# Altium schematic sheet Microphone.SchDoc
size A4; DocumentNumber: 8; SheetNumber: 8; SheetTotal: 8
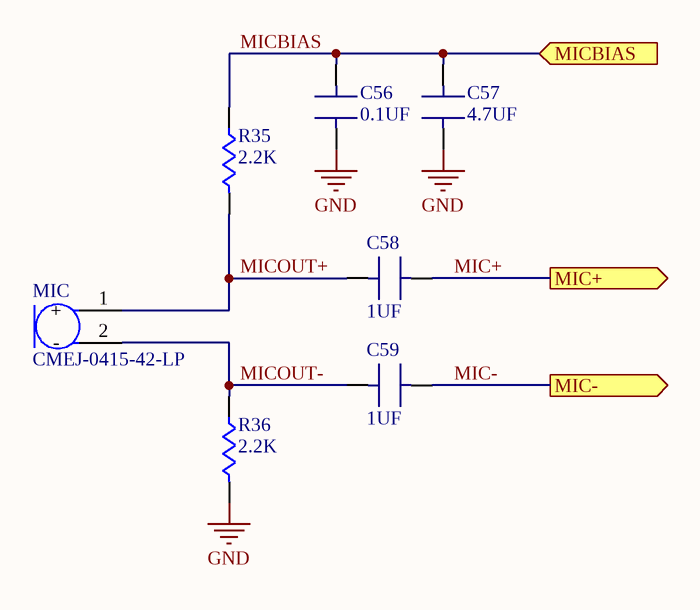
[diagram p0: Microphone.SchDoc]

## Parts
C56  0.1UF  [CAP: 0603]
C57  4.7UF  [CAP: 0805]
C58  1UF  [CAP: 0603]
C59  1UF  [CAP: 0603]
MIC  CMEJ-0415-42-LP  [CMEJ041542LP]
R35  2.2K  [RES: 0603]
R36  2.2K  [RES: 0603]

## Ports
MIC+ (out), MIC- (out), MICBIAS (in)

## Nets
GND: C56.2(B) C57.1(A) R36.1
MIC+: C58.2(B) ; port MIC+
MIC-: C59.2(B) ; port MIC-
MICBIAS: C56.1(A) C57.2(B) R35.2 ; port MICBIAS
MICOUT+: C58.1(A) MIC.1(+) R35.1
MICOUT-: C59.1(A) MIC.2(-) R36.2

## Notes on the sheet
- Size:
- Date:
- Sheet Name:
- A4
- Sheet
- Time:
- of
- Author :
- Hatim Saad
- Project:
- File:

## Library data of the parts
C56 C58 C59 = CAP 0603: CAP SMD 0603
C57 = CAP 0805: CAP SMD 0805
MIC = CMEJ-0415-42-LP: 4.0 mm, Omnidirectional, PCB Mount, 2.0 Vdc, Elecret Condenser Microphone; Manufacturer: CUI Devices; Supplier 1: Mouser; Manufacturer Part Number: CMEJ-0415-42-LP; RoHS: No; Category: Microphones; Stock 1: 3285; Pricing 1: 1=0.43, 10=0.367, 50=0.367, 100=0.308, 1000=0.254, 10000=0.209 (USD); ComponentLink1URL: https://www.cuidevices.com/product/resource/digikeypdf/cmej-0415-42-lp.pdf?src-supplier=Digi-Key; ComponentLink1Description: https://www.cuidevices.com/product/resource/digikeypdf/cmej-0415-42-lp.pdf?src-supplier=Digi-Key; Supplier Part Number 1: 490-CMEJ-0415-42-LP
R35 R36 = RES 0603: RES SMD 0603